# Altium project 20211129_mach tren NCKH.PrjPcb
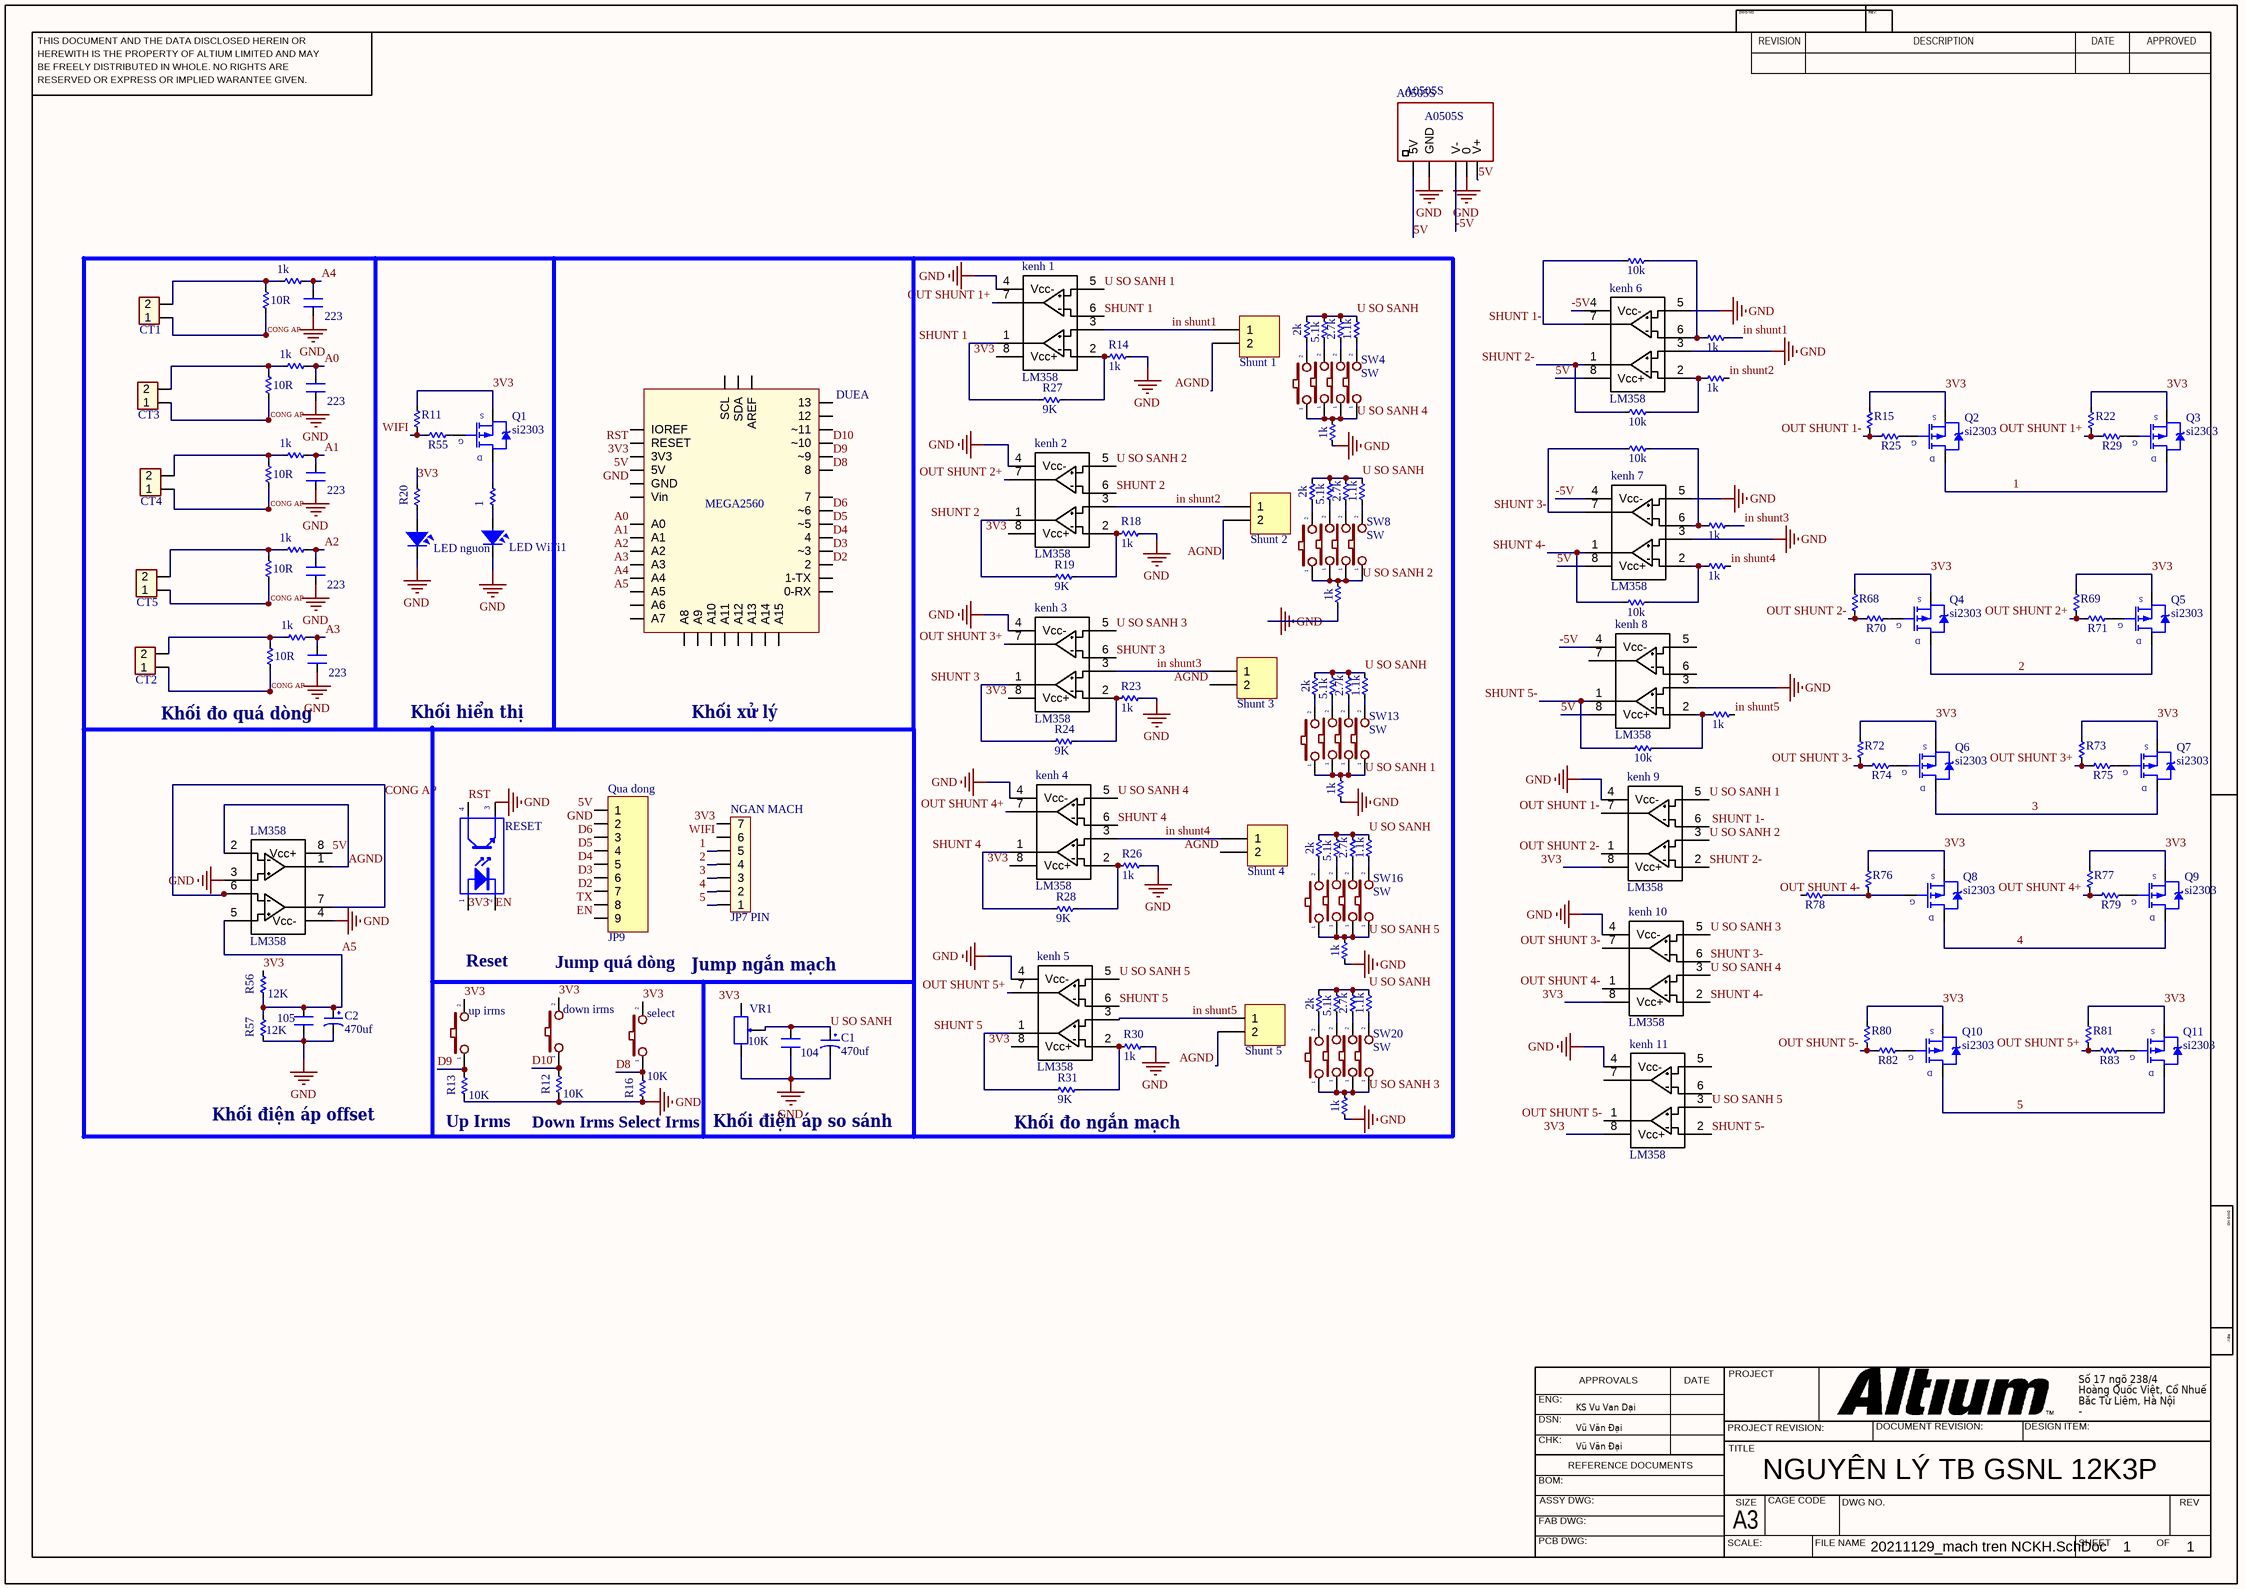
[diagram p0: 20211129_mach tren NCKH.SchDoc]
1 sheet, 157 parts. Net scope: global (net labels, ports and power ports of the same name join across sheets).
Board files: 20211129_mach tren NCKH.PcbDoc, in.PcbDoc

## Sheet 20211129_mach tren NCKH.SchDoc: NGUYÊN LÝ TB GSNL 12K3P
size 420 x 297 mm; Date: T3; ApprovedBy: Vũ Văn Đại; CheckedBy: Vũ Văn Đại; Author: Vũ Văn Đại; DrawnBy: Vũ Văn Đại; Engineer: KS Vu Van Dại; Organization: IOTeamVN; Address1: Số 17 ngõ 238/4; Address2: Hoàng Quốc Việt, Cổ Nhuế; Address3: Băc Từ Liêm, Hà Nội; Address4: -; DocumentNumber: 01; Revision: 1.01; SheetNumber: 1; SheetTotal: 1; Time: 06:00

### Parts
1  470  [RES-SMD-0805]  (value not drawn)
A0505S  A0505S  [A0505S]
C1  470uf  [CP1/2]
C2  470uf  [CP1/2]
C3  104  [CN-SMD-0805]
C6  105  [CN-SMD-0805]
cc1  223  [CN-SMD-0805]
cc4  223  [CN-SMD-0805]
cc5  223  [CN-SMD-0805]
cc6  223  [CN-SMD-0805]
cc7  223  [CN-SMD-0805]
CT1  Termial 2.54 2P  [Termial 2P 2.54]  (value not drawn)
CT2  Termial 2.54 2P  [Termial 2P 2.54]  (value not drawn)
CT3  Termial 2.54 2P  [Termial 2P 2.54]  (value not drawn)
CT4  Termial 2.54 2P  [Termial 2P 2.54]  (value not drawn)
CT5  Termial 2.54 2P  [Termial 2P 2.54]  (value not drawn)
down_irms  SW  [SW1-DIP]  (value not drawn)
DUE  Arduino DUE  [Arduino MEGA2560]  (value not drawn)  (part A of 2)
kenh_1  LM358  [DIP8]
kenh_2  LM358  [DIP8]
kenh_3  LM358  [DIP8]
kenh_4  LM358  [DIP8]
kenh_5  LM358  [DIP8]
kenh_6  LM358  [DIP8]
kenh_7  LM358  [DIP8]
kenh_8  LM358  [DIP8]
kenh_9  LM358  [SO8]
kenh_10  LM358  [SO8]
kenh_11  LM358  [SO8]
LED_nguon  LED  [LED-0805-Blue]  (value not drawn)
LED_WiFi1  LED  [LED-0805-Green]  (value not drawn)
LM358  LM358  [DIP8]
NGAN_MACH  JP7 PIN  [JP7]
Q1  si2303  [si2303]
Q2  si2303  [si2303]
Q3  si2303  [si2303]
Q4  si2303  [si2303]
Q5  si2303  [si2303]
Q6  si2303  [si2303]
Q7  si2303  [si2303]
Q8  si2303  [si2303]
Q9  si2303  [si2303]
Q10  si2303  [si2303]
Q11  si2303  [si2303]
Qua_dong  JP9  [JP9-D1C]
R1  1k  [RES-SMD-0805]
R2  10R  [RES-SMD-0805]
R3  1k  [RES-SMD-0805]
R4  10R  [RES-SMD-0805]
R5  1k  [RES-SMD-0805]
R6  10R  [RES-SMD-0805]
R7  1k  [RES-SMD-0805]
R8  10R  [RES-SMD-0805]
R9  1k  [RES-SMD-0805]
R10  10R  [RES-SMD-0805]
R11  470  [RES-SMD-0805]  (value not drawn)
R12  10K  [RES-SMD-0805]
R13  10K  [RES-SMD-0805]
R14  1k  [RES-SMD-0805]
R15  470  [RES-SMD-0805]  (value not drawn)
R16  10K  [RES-SMD-0805]
R17  2k  [RES-SMD-0805]
R18  1k  [RES-SMD-0805]
R19  9K  [RES-SMD-0805]
R20  470  [RES-SMD-0805]  (value not drawn)
R21  5.1k  [RES-SMD-0805]
R22  470  [RES-SMD-0805]  (value not drawn)
R23  1k  [RES-SMD-0805]
R24  9K  [RES-SMD-0805]
R25  470  [RES-SMD-0805]  (value not drawn)
R26  1k  [RES-SMD-0805]
R27  9K  [RES-SMD-0805]
R28  9K  [RES-SMD-0805]
R29  470  [RES-SMD-0805]  (value not drawn)
R30  1k  [RES-SMD-0805]
R31  9K  [RES-SMD-0805]
R32  2.7k  [RES-SMD-0805]
R33  1.1k  [RES-SMD-0805]
R34  2k  [RES-SMD-0805]
R35  5.1k  [RES-SMD-0805]
R36  2.7k  [RES-SMD-0805]
R37  1.1k  [RES-SMD-0805]
R38  1k  [RES-SMD-0805]
R39  1k  [RES-SMD-0805]
R40  2k  [RES-SMD-0805]
R41  5.1k  [RES-SMD-0805]
R42  2.7k  [RES-SMD-0805]
R43  1.1k  [RES-SMD-0805]
R44  1k  [RES-SMD-0805]
R45  2k  [RES-SMD-0805]
R46  5.1k  [RES-SMD-0805]
R47  2.7k  [RES-SMD-0805]
R48  1.1k  [RES-SMD-0805]
R49  1k  [RES-SMD-0805]
R50  2k  [RES-SMD-0805]
R51  5.1k  [RES-SMD-0805]
R52  2.7k  [RES-SMD-0805]
R53  1.1k  [RES-SMD-0805]
R54  1k  [RES-SMD-0805]
R55  470  [RES-SMD-0805]  (value not drawn)
R56  12K  [RES-SMD-0805]
R57  12K  [RES-SMD-0805]
R58  10k  [RES-SMD-0805]
R59  1k  [RES-SMD-0805]
R60  1k  [RES-SMD-0805]
R61  10k  [RES-SMD-0805]
R62  1k  [RES-SMD-0805]
R63  1k  [RES-SMD-0805]
R64  1k  [RES-SMD-0805]
R65  10k  [RES-SMD-0805]
R66  10k  [RES-SMD-0805]
R67  10k  [RES-SMD-0805]
R68  470  [RES-SMD-0805]  (value not drawn)
R69  470  [RES-SMD-0805]  (value not drawn)
R70  470  [RES-SMD-0805]  (value not drawn)
R71  470  [RES-SMD-0805]  (value not drawn)
R72  470  [RES-SMD-0805]  (value not drawn)
R73  470  [RES-SMD-0805]  (value not drawn)
R74  470  [RES-SMD-0805]  (value not drawn)
R75  470  [RES-SMD-0805]  (value not drawn)
R76  470  [RES-SMD-0805]  (value not drawn)
R77  470  [RES-SMD-0805]  (value not drawn)
R78  470  [RES-SMD-0805]  (value not drawn)
R79  470  [RES-SMD-0805]  (value not drawn)
R80  470  [RES-SMD-0805]  (value not drawn)
R81  470  [RES-SMD-0805]  (value not drawn)
R82  470  [RES-SMD-0805]  (value not drawn)
R83  470  [RES-SMD-0805]  (value not drawn)
RESET  PC817  [DIP4]  (value not drawn)
select  SW  [SW1-DIP]  (value not drawn)
Shunt_1  Header 2_1  [HED2]  (value not drawn)
Shunt_2  Header 2_1  [HED2]  (value not drawn)
Shunt_3  Header 2_1  [HED2]  (value not drawn)
Shunt_4  Header 2_1  [HED2]  (value not drawn)
Shunt_5  Header 2_1  [HED2]  (value not drawn)
SW1  SW  [SW-DIP1-1]  (value not drawn)
SW2  SW  [SW-DIP1-1]  (value not drawn)
SW3  SW  [SW-DIP1-1]  (value not drawn)
SW4  SW  [SW-DIP1-1]
SW5  SW  [SW-DIP1-1]  (value not drawn)
SW6  SW  [SW-DIP1-1]  (value not drawn)
SW7  SW  [SW-DIP1-1]  (value not drawn)
SW8  SW  [SW-DIP1-1]
SW9  SW  [SW-DIP1-1]  (value not drawn)
SW10  SW  [SW-DIP1-1]  (value not drawn)
SW11  SW  [SW-DIP1-1]  (value not drawn)
SW12  SW  [SW-DIP1-1]  (value not drawn)
SW13  SW  [SW-DIP1-1]
SW14  SW  [SW-DIP1-1]  (value not drawn)
SW15  SW  [SW-DIP1-1]  (value not drawn)
SW16  SW  [SW-DIP1-1]
SW17  SW  [SW-DIP1-1]  (value not drawn)
SW18  SW  [SW-DIP1-1]  (value not drawn)
SW19  SW  [SW-DIP1-1]  (value not drawn)
SW20  SW  [SW-DIP1-1]
up_irms  SW  [SW1-DIP]  (value not drawn)
VR1  10K  [VR1]

### Nets
GND: A0505S.0 A0505S.GND C1.2 C2.2 C3.2 C6.2 cc1.2 cc4.2 cc5.2 cc6.2 cc7.2 DUE.GND kenh_1.4(Vcc-) kenh_2.4(Vcc-) kenh_3.4(Vcc-) kenh_4.4(Vcc-) kenh_5.4(Vcc-) kenh_6.3 kenh_6.5 kenh_7.3 kenh_7.5 kenh_8.3 kenh_9.4(Vcc-) kenh_10.4(Vcc-) kenh_11.4(Vcc-) LED_nguon.2 LED_WiFi1.2 LM358.3 LM358.4(Vcc-) Qua_dong.2 R12.1 R13.1 R14.2 R16.1 R18.2 R23.2 R26.2 R30.2 R38.1 R39.1 R44.1 R49.1 R54.1 R57.1 RESET.3(E) VR1.3
1: NGAN_MACH.5 Q2.3(D) Q3.3(D)
2: NGAN_MACH.4 Q4.3(D) Q5.3(D)
3: NGAN_MACH.3 Q6.3(D) Q7.3(D)
3V3: down_irms.2 DUE.3V3 kenh_1.8(Vcc+) kenh_2.8(Vcc+) kenh_3.8(Vcc+) kenh_4.8(Vcc+) kenh_5.8(Vcc+) kenh_9.8(Vcc+) kenh_10.8(Vcc+) kenh_11.8(Vcc+) NGAN_MACH.7 Q1.2(S) Q2.2(S) Q3.2(S) Q4.2(S) Q5.2(S) Q6.2(S) Q7.2(S) Q8.2(S) Q9.2(S) Q10.2(S) Q11.2(S) R11.1 R15.1 R20.2 R22.1 R56.2 R68.1 R69.1 R72.1 R73.1 R76.1 R77.1 R80.1 R81.1 RESET.1(A) select.2 up_irms.2 VR1.1
4: NGAN_MACH.2 Q8.3(D) Q9.3(D)
5: NGAN_MACH.1 Q10.3(D) Q11.3(D)
5V: A0505S.5V A0505S.V+ DUE.5V kenh_6.8(Vcc+) kenh_7.8(Vcc+) kenh_8.8(Vcc+) LM358.8(Vcc+) Qua_dong.1
-5V: A0505S.V- kenh_6.4(Vcc-) kenh_7.4(Vcc-) kenh_8.4(Vcc-)
A0: cc5.1 DUE.A0 R5.1
A1: cc6.1 DUE.A1 R7.1
A2: cc7.1 DUE.A2 R9.1
A3: cc1.1 DUE.A3 R3.1
A4: cc4.1 DUE.A4 R1.1
A5: C2.1 C6.1 DUE.A5 LM358.5 R56.1 R57.2
AGND: LM358.1 LM358.2 Shunt_1.2 Shunt_2.2 Shunt_3.2 Shunt_4.2 Shunt_5.2
CONG AP: CT1.1 CT2.1 CT3.1 CT4.1 CT5.1 LM358.6 LM358.7 R2.1 R4.1 R6.1 R8.1 R10.1
D2: DUE.2 Qua_dong.7
D3: DUE.~3 Qua_dong.6
D4: DUE.4 Qua_dong.5
D5: DUE.~5 Qua_dong.4
D6: DUE.~6 Qua_dong.3
D8: DUE.8 R16.2 select.1
D9: DUE.~9 R13.2 up_irms.1
D10: down_irms.1 DUE.~10 R12.2
EN: Qua_dong.9 RESET.2(K)
in shunt1: kenh_1.3 R59.1 Shunt_1.1
in shunt2: kenh_2.3 R60.1 Shunt_2.1
in shunt3: kenh_3.3 R62.1 Shunt_3.1
in shunt4: kenh_4.3 R63.1 Shunt_4.1
in shunt5: kenh_5.3 R64.1 Shunt_5.1
OUT SHUNT 1+: kenh_1.7 R22.2 R29.2
OUT SHUNT 1-: kenh_9.7 R15.2 R25.2
OUT SHUNT 2+: kenh_2.7 R69.2 R71.2
OUT SHUNT 2-: kenh_9.1 R68.2 R70.2
OUT SHUNT 3+: kenh_3.7 R73.2 R75.2
OUT SHUNT 3-: kenh_10.7 R72.2 R74.2
OUT SHUNT 4+: kenh_4.7 R77.2 R79.2
OUT SHUNT 4-: kenh_10.1 Q8.1(G) R76.2 R78.1
OUT SHUNT 5+: kenh_5.7 R81.2 R83.2
OUT SHUNT 5-: kenh_11.1 R80.2 R82.2
RST: DUE.RESET RESET.4(C)
SHUNT 1: kenh_1.1 kenh_1.6 R27.1
SHUNT 1-: kenh_6.7 R58.2
SHUNT 2: kenh_2.1 kenh_2.6 R19.1
SHUNT 2-: kenh_6.1 kenh_9.2 R65.2
SHUNT 3: kenh_3.1 kenh_3.6 R24.1
SHUNT 3-: kenh_7.7 kenh_10.6 R61.2
SHUNT 4: kenh_4.1 kenh_4.6 R28.1
SHUNT 4-: kenh_7.1 kenh_10.2 R66.2
SHUNT 5: kenh_5.1 kenh_5.6 R31.1
SHUNT 5-: kenh_8.1 kenh_11.2 R67.2
TX: Qua_dong.8
U SO SANH: C1.1 C3.1 R17.2 R21.2 R32.2 R33.2 R34.2 R35.2 R36.2 R37.2 R40.2 R41.2 R42.2 R43.2 R45.2 R46.2 R47.2 R48.2 R50.2 R51.2 R52.2 R53.2 VR1.2
U SO SANH 1: kenh_1.5 kenh_9.5 R44.2 SW9.1 SW10.1 SW11.1 SW13.1
U SO SANH 2: kenh_2.5 kenh_9.3 R39.2 SW5.1 SW6.1 SW7.1 SW8.1
U SO SANH 3: kenh_3.5 kenh_10.5 R54.2 SW17.1 SW18.1 SW19.1 SW20.1
U SO SANH 4: kenh_4.5 kenh_10.3 R38.2 SW1.1 SW2.1 SW3.1 SW4.1
U SO SANH 5: kenh_5.5 kenh_11.3 R49.2 SW12.1 SW14.1 SW15.1 SW16.1
WIFI: NGAN_MACH.6 R11.2 R55.2
Net1_1: 1.1 LED_WiFi1.1
Net1_2: 1.2 Q1.3(D)
NetCT1_2: CT1.2 R1.2 R2.2
NetCT2_2: CT2.2 R3.2 R4.2
NetCT3_2: CT3.2 R5.2 R6.2
NetCT4_2: CT4.2 R7.2 R8.2
NetCT5_2: CT5.2 R9.2 R10.2
Netkenh_1_2: kenh_1.2 R14.1 R27.2
Netkenh_2_2: kenh_2.2 R18.1 R19.2
Netkenh_3_2: kenh_3.2 R23.1 R24.2
Netkenh_4_2: kenh_4.2 R26.1 R28.2
Netkenh_5_2: kenh_5.2 R30.1 R31.2
Netkenh_6_2: kenh_6.2 R60.2 R65.1
Netkenh_6_6: kenh_6.6 R58.1 R59.2
Netkenh_7_2: kenh_7.2 R63.2 R66.1
Netkenh_7_6: kenh_7.6 R61.1 R62.2
Netkenh_8_2: kenh_8.2 R64.2 R67.1
NetLED_nguon_1: LED_nguon.1 R20.1
NetQ1_1: Q1.1(G) R55.1
NetQ2_1: Q2.1(G) R25.1
NetQ3_1: Q3.1(G) R29.1
NetQ4_1: Q4.1(G) R70.1
NetQ5_1: Q5.1(G) R71.1
NetQ6_1: Q6.1(G) R74.1
NetQ7_1: Q7.1(G) R75.1
NetQ9_1: Q9.1(G) R79.1
NetQ10_1: Q10.1(G) R82.1
NetQ11_1: Q11.1(G) R83.1
NetR17_1: R17.1 SW5.2
NetR21_1: R21.1 SW6.2
NetR32_1: R32.1 SW7.2
NetR33_1: R33.1 SW8.2
NetR34_1: R34.1 SW3.2
NetR35_1: R35.1 SW1.2
NetR36_1: R36.1 SW2.2
NetR37_1: R37.1 SW4.2
NetR40_1: R40.1 SW9.2
NetR41_1: R41.1 SW10.2
NetR42_1: R42.1 SW11.2
NetR43_1: R43.1 SW13.2
NetR45_1: R45.1 SW12.2
NetR46_1: R46.1 SW14.2
NetR47_1: R47.1 SW15.2
NetR48_1: R48.1 SW16.2
NetR50_1: R50.1 SW17.2
NetR51_1: R51.1 SW18.2
NetR52_1: R52.1 SW19.2
NetR53_1: R53.1 SW20.2

Not connected (* = marked no-connect by the designer): DUE 0-RX 1-TX 7 12 13 A6 A7 A8 A9 A10 A11 A12 A13 A14 A15 AREF IOREF SCL SDA Vin ~11; kenh_8 5 6 7; kenh_9 6; kenh_11 5 6 7; R78 2

### Notes on the sheet
- Khối đo quá dòng
- Khối hiển thị
- Khối xử lý
- Reset
- Jump quá dòng
- Jump ngắn mạch
- Khối điện áp offset
- (near R13) Up Irms
- (near R12) Down Irms
- (near R16) Select Irms
- Khối điện áp so sánh
- (near R31) Khối đo ngắn mạch
- Labels drawn without touching a wire or pin: SHUNT 1-
- THIS DOCUMENT AND THE DATA DISCLOSED HEREIN OR
- HEREWITH IS THE PROPERTY OF ALTIUM LIMITED AND MAY
- DWG NO:
- REVISION
- REV:
- DESCRIPTION
- DATE
- APPROVED
- BE FREELY DISTRIBUTED IN WHOLE. NO RIGHTS ARE
- RESERVED OR EXPRESS OR IMPLIED WARANTEE GIVEN.
- ENG:
- APPROVALS
- PROJECT
- DSN:
- CHK:
- REFERENCE DOCUMENTS
- PROJECT REVISION:
- TITLE
- DOCUMENT REVISION:
- DESIGN ITEM:
- BOM:
- FAB DWG:
- PCB DWG:
- ASSY DWG:
- SCALE:
- A3
- SIZE
- CAGE CODE
- FILE NAME
- DWG NO.
- SHEET
- OF
- REV
- (in symbol Arduino Mega2560, part A) MEGA2560

### Library data of the parts
1 R1-R83 = Res: Manufacturer: Generic Components; Class: Passive; SubClass: R; Published: 08/06/2000; Publisher: Altium Hobart Technology Centre
C1 C2 = CP1: Cap P  0,1uF < 22uF , 16 - 50V; Value: 10uF/50V; Description 1: 10 => 220uF/6,3V/10V - 10uF => 100uF/16V; Description 2: 0,1uF => 33uF/50V - 10uF => 22uF/63V; Description 3: 0,47uF => 10uF/100V
C3 C6 cc1 cc4-cc7 = CN: Value: 33pF
CT1-CT5 = Termial 2P 2.54: Header IDC, 2 x 1 Pin Vertical 2.54mm Pitch (Non-Boxed, Male); Manufacturer: W¨¹rth Elektronik eiSos GmbH; partNo: 613002143121; ComponentLink1 Description: Manufacturer; ComponentLink2 Description: Datasheet; NoPins: 02; Created Date: 29 March 2013; ComponentLink1URL: http://www.we-online.com; ComponentLink2URL: http://katalog.we-online.de/em/datasheet/6130xx143121.pdf; Created by: Karrer Zheng
down_irms select SW1-SW20 up_irms = SW2: Switch button 2 pin; Value: SW chip 2 pin
DUE = Arduino Mega2560: Value: Cau 1A
kenh_1-kenh_11 LM358 = LM393: IC DUAL COMPARATOR
LED_nguon LED_WiFi1 = LED SMD: Value: LED 3 - 5 ly 2 Colour
NGAN_MACH = JP7: Value: JP7
Q1-Q11 = si2303: Value: IRF840
Qua_dong = JP9: WR-PHD 2.54 mm Angled Socket Header; Manufacturer: W¨¹rth Elektronik eiSos GmbH; partNo: 613009143121; ComponentLink1 Description: Manufacturer; ComponentLink2 Description: Datasheet; NoPins: 09; Created Date: 29 March 2013; ComponentLink1URL: http://www.we-online.com; ComponentLink2URL: http://katalog.we-online.de/em/datasheet/6130xx143121.pdf; Created by: Karrer Zheng
RESET = PC817: Single Opto; Value: PC817
Shunt_1-Shunt_5 = Header 2_1: Header, 2-Pin; Manufacturer: Generic Components; Class: Connector; Value: Header 2
VR1 = VR: Var Resistor; Value: VR 10K